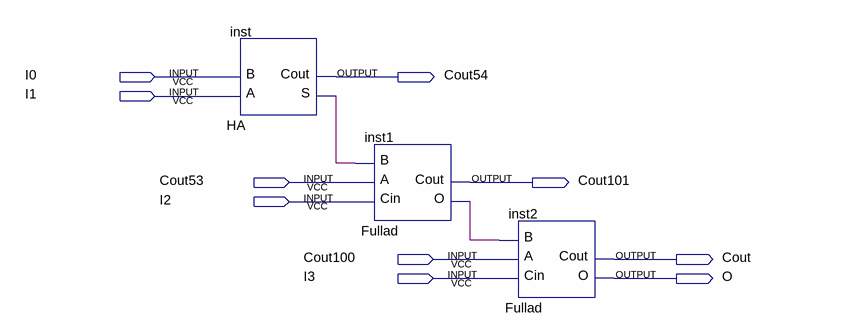
[diagram p0: schematic sheet]
// Quartus schematic B7.bdf as structural Verilog: 3 symbols, 10 pins
module B7 (
  input  I0,
  input  I1,
  input  Cout53,
  input  I2,
  input  Cout100,
  input  I3,
  output Cout54,
  output Cout101,
  output Cout,
  output O
);

  wire inst1_o, inst_s;

  HA inst (.A(I1), .B(I0), .S(inst_s), .Cout(Cout54));
  Fullad inst1 (.Cin(I2), .A(Cout53), .B(inst_s), .O(inst1_o), .Cout(Cout101));
  Fullad inst2 (.Cin(I3), .A(Cout100), .B(inst1_o), .O(O), .Cout(Cout));
endmodule
